# Altium project FM.PrjPcb
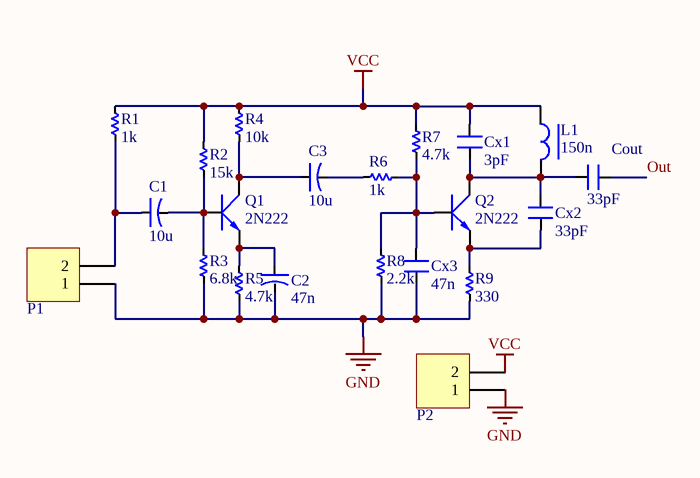
[diagram p0: Sche.SchDoc]
1 sheet, 21 parts. Net scope: global (net labels, ports and power ports of the same name join across sheets).
Board files: PCB1.PcbDoc, PCB.PcbDoc

## Sheet Sche.SchDoc
size A

### Parts
C1  10u  [CA-ALU-2.54]
C2  47n  [CA-ALU-2.54]
C3  10u  [CA-ALU-2.54]
Cout  33pF  [CN-SMD-0805]
Cx1  3pF  [CN-SMD-0805]
Cx2  33pF  [CN-SMD-0805]
Cx3  47n  [CN-SMD-0805]
L1  150n  [RES-1/8W-SMALL]
P1  Domino 2  [DOMINO 2- 5mm]  (value not drawn)
P2  Domino 2  [DOMINO 2- 5mm]  (value not drawn)
Q1  2N222  [TO92-123]
Q2  2N222  [TO92-123]
R1  1k  [RES-SMD-0805]
R2  15k  [RES-SMD-0805]
R3  6.8k  [RES-SMD-0805]
R4  10k  [RES-SMD-0805]
R5  4.7k  [RES-SMD-0805]
R6  1k  [RES-SMD-0805]
R7  4.7k  [RES-SMD-0805]
R8  2.2k  [RES-SMD-0805]
R9  330  [RES-SMD-0805]

### Nets
GND: C2.2 Cx3.1 P1.1 P2.1 R3.2 R5.2 R8.2 R9.2
VCC: Cx1.2 L1.1 P2.2 R1.1 R2.1 R4.1 R7.1
Out: Cout.1
NetC1_1: C1.1 P1.2 R1.2
NetC1_2: C1.2 Q1.2(B) R2.2 R3.1
NetC2_1: C2.1 Q1.1(E) R5.1
NetC3_1: C3.1 Q1.3(C) R4.2
NetC3_2: C3.2 R6.1
NetCout_2: Cout.2 Cx1.1 Cx2.2 L1.2 Q2.3(C)
NetCx2_1: Cx2.1 Q2.1(E) R9.1
NetCx3_2: Cx3.2 Q2.2(B) R6.2 R7.2 R8.1

### Library data of the parts
C1-C3 = CN-ALU-DIP: Capacitor (Semiconductor SIM Model); Value: 104; LatestRevisionDate: 17-Jul-2002; LatestRevisionNote: Re-released for DXP Platform.; PackageReference: C1206; Publisher: Altium Limited
Cout Cx2 = CN: Value: 33pF
Cx1 Cx3 = CN: Value: 33pF
L1 = L-DIP-1: Inductor; Value: 150 mH
P1 P2 = Domino 2: Domino, 2-Pin; LatestRevisionDate: 17-Jul-2002; LatestRevisionNote: Re-released for DXP Platform.; Publisher: Altium Limited
Q1 Q2 = 2N222: NPN 600mW, ECB; Value: C1815
R1-R9 = Res-SMD: Resistor; Manufacturer: Generic Components; Class: Passive; Published: 08/06/2000; Publisher: Altium Hobart Technology Centre